# Altium schematic sheet Handmouse.SchDoc
size A4
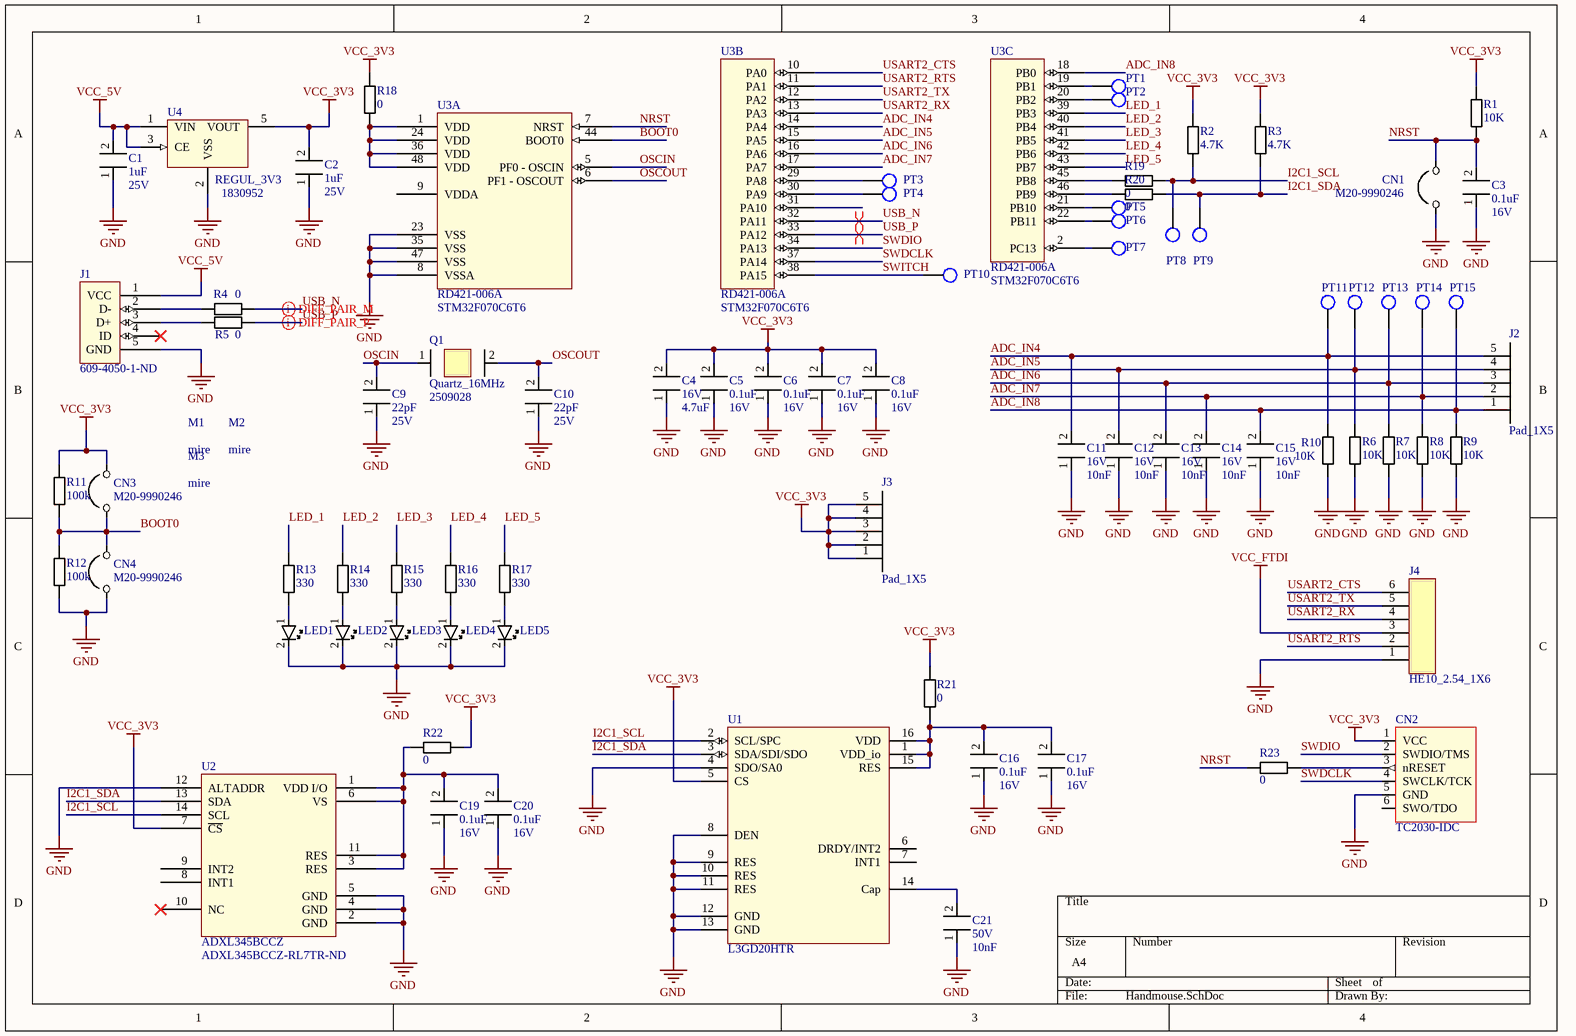
[diagram p0: Handmouse.SchDoc]

## Parts
C1  Capacité: 1uF  Voltage: 25V  [0603]  (hidden comment: RD401-021A)
C2  Capacité: 1uF  Voltage: 25V  [0603]  (hidden comment: RD401-021A)
C3  Capacité: 0.1uF  Voltage: 16V  [0402]  (hidden comment: RD401-033A)
C4  Voltage: 16V  Capacité: 4.7uF  [0805]
C5  Capacité: 0.1uF  Voltage: 16V  [0402]  (hidden comment: RD401-033A)
C6  Capacité: 0.1uF  Voltage: 16V  [0402]  (hidden comment: RD401-033A)
C7  Capacité: 0.1uF  Voltage: 16V  [0402]  (hidden comment: RD401-033A)
C8  Capacité: 0.1uF  Voltage: 16V  [0402]  (hidden comment: RD401-033A)
C9  Voltage: 25V  [0402]  (hidden comment: 22pF)
C10  Voltage: 25V  [0402]  (hidden comment: 22pF)
C11  Voltage: 16V  Capacité: 10nF  [0402]  (hidden comment: RD401-008A)
C12  Voltage: 16V  Capacité: 10nF  [0402]  (hidden comment: RD401-008A)
C13  Voltage: 16V  Capacité: 10nF  [0402]  (hidden comment: RD401-008A)
C14  Voltage: 16V  Capacité: 10nF  [0402]  (hidden comment: RD401-008A)
C15  Voltage: 16V  Capacité: 10nF  [0402]  (hidden comment: RD401-008A)
C16  Capacité: 0.1uF  Voltage: 16V  [0402]  (hidden comment: RD401-033A)
C17  Capacité: 0.1uF  Voltage: 16V  [0402]  (hidden comment: RD401-033A)
C19  Capacité: 0.1uF  Voltage: 16V  [0402]  (hidden comment: RD401-033A)
C20  Capacité: 0.1uF  Voltage: 16V  [0402]  (hidden comment: RD401-033A)
C21  Voltage: 50V  Capacite: 10nF  [0402]  (hidden comment: RD401-037A)
CN1  Manufacturer Part Number 1: M20-9990246  [PinHead 2*1 M]  (hidden comment: RD408-013A)
CN2  Manufacturer Part Number: TC2030-IDC  [TC2030-IDC-FP]  (hidden comment: RD408-022A)
CN3  Manufacturer Part Number 1: M20-9990246  [PinHead 2*1 M]  (hidden comment: RD408-013A)
CN4  Manufacturer Part Number 1: M20-9990246  [PinHead 2*1 M]  (hidden comment: RD408-013A)
J1  Supplier Part Number 1: 609-4050-1-ND  [CONN_10103594-0001LF]  (hidden comment: CONN_FCI_10103594-0001LF)
J2  Pad_1X5  [PCBComponent_1]
J3  Pad_1X5  [PCBComponent_1]
J4  HE10_2.54_1X6  [PCBComponent_1 - duplicate]
LED1  RD405-006A  [0805]  (value not drawn)
LED2  RD405-006A  [0805]  (value not drawn)
LED3  RD405-006A  [0805]  (value not drawn)
LED4  RD405-006A  [0805]  (value not drawn)
LED5  RD405-006A  [0805]  (value not drawn)
M1  mire  [Mire]
M2  mire  [Mire]
M3  mire  [Mire]
PT1  PT 0.8mm  [Pastille_0.8mm]  (value not drawn)
PT2  PT 0.8mm  [Pastille_0.8mm]  (value not drawn)
PT3  PT 0.8mm  [Pastille_0.8mm]  (value not drawn)
PT4  PT 0.8mm  [Pastille_0.8mm]  (value not drawn)
PT5  PT 0.8mm  [Pastille_0.8mm]  (value not drawn)
PT6  PT 0.8mm  [Pastille_0.8mm]  (value not drawn)
PT7  PT 0.8mm  [Pastille_0.8mm]  (value not drawn)
PT8  PT 0.8mm  [Pastille_0.8mm]  (value not drawn)
PT9  PT 0.8mm  [Pastille_0.8mm]  (value not drawn)
PT10  PT 0.8mm  [Pastille_0.8mm]  (value not drawn)
PT11  PT 0.8mm  [Pastille_0.8mm]  (value not drawn)
PT12  PT 0.8mm  [Pastille_0.8mm]  (value not drawn)
PT13  PT 0.8mm  [Pastille_0.8mm]  (value not drawn)
PT14  PT 0.8mm  [Pastille_0.8mm]  (value not drawn)
PT15  PT 0.8mm  [Pastille_0.8mm]  (value not drawn)
Q1  Quartz_16MHz  Supplier Part Number 1: 2509028  [PCBComponent_1 - duplicate2]
R1  Resistance: 10K  [0603]  (hidden comment: RD403-054A)
R2  Résistance (Ohms): 4.7K  [0603]  (hidden comment: RD403-046A)
R3  Résistance (Ohms): 4.7K  [0603]  (hidden comment: RD403-046A)
R4  Résistance: 0  [0603]  (hidden comment: RD403-044A)
R5  Résistance: 0  [0603]  (hidden comment: RD403-044A)
R6  Resistance: 10K  [0603]  (hidden comment: RD403-054A)
R7  Resistance: 10K  [0603]  (hidden comment: RD403-054A)
R8  Resistance: 10K  [0603]  (hidden comment: RD403-054A)
R9  Resistance: 10K  [0603]  (hidden comment: RD403-054A)
R10  Resistance: 10K  [0603]  (hidden comment: RD403-054A)
R11  100k  [0402]
R12  100k  [0402]
R13  330  [0402]
R14  330  [0402]
R15  330  [0402]
R16  330  [0402]
R17  330  [0402]
R18  Résistance: 0  [0603]  (hidden comment: RD403-044A)
R19  Résistance: 0  [0603]  (hidden comment: RD403-044A)
R20  Résistance: 0  [0603]  (hidden comment: RD403-044A)
R21  Résistance: 0  [0603]  (hidden comment: RD403-044A)
R22  Résistance: 0  [0603]  (hidden comment: RD403-044A)
R23  Résistance: 0  [0603]  (hidden comment: RD403-044A)
U1  Manufacturer Part Number 1: L3GD20HTR  [LGA_50P_300X300_16]  (hidden comment: RD498-005A)
U2  ADXL345BCCZ  Supplier Part Number 1: ADXL345BCCZ-RL7TR-ND  [PCBComponent_1 - duplicate1]
U3  RD421-006A  [LQFP48]  (parts A,B,C of 3)
U4  REGUL_3V3  Supplier Part Number 1: 1830952  [SOIC95P280X130-5]

## Nets
GND: C1.1 C2.1 C3.1 C4.1 C5.1 C6.1 C7.1 C8.1 C9.1 C10.1 C11.1 C12.1 C13.1 C14.1 C15.1 C16.1 C17.1 C19.1 C20.1 C21.1 CN1.1 CN2.5(GND) CN4.1 J1.5(GND) J4.1 LED1.2 LED2.2 LED3.2 LED4.2 LED5.2 R6.1 R7.1 R8.1 R9.1 R10.1 R12.1 U1.4(SDO/SA0) U1.8(DEN) U1.9(RES) U1.10(RES) U1.11(RES) U1.12(GND) U1.13(GND) U2.2(GND) U2.4(GND) U2.5(GND) U2.12(ALTADDR) U3.8(VSSA) U3.23(VSS) U3.35(VSS) U3.47(VSS) U4.2(VSS)
VCC_3V3: C2.2 C4.2 C5.2 C6.2 C7.2 C8.2 CN2.1(VCC) CN3.2 J3.1 J3.2 J3.3 J3.4 J3.5 R1.2 R2.2 R3.2 R11.2 R18.2 R21.2 R22.2 U1.5(CS) U2.7(~{CS}) U4.5(VOUT)
VCC_5V: C1.2 J1.1(VCC) U4.1(VIN) U4.3(CE)
VCC_FTDI: J4.3
ADC_IN4: C11.2 J2.5 PT11.1 R10.2 U3.14(PA4)
ADC_IN5: C12.2 J2.4 PT12.1 R6.2 U3.15(PA5)
ADC_IN6: C13.2 J2.3 PT13.1 R7.2 U3.16(PA6)
ADC_IN7: C14.2 J2.2 PT14.1 R8.2 U3.17(PA7)
ADC_IN8: C15.2 J2.1 PT15.1 R9.2 U3.18(PB0)
BOOT0: CN3.1 CN4.2 R11.1 R12.2 U3.44(BOOT0)
I2C1_SCL: PT8.1 R2.1 R19.2 U1.2(SCL/SPC) U2.14(SCL)
I2C1_SDA: PT9.1 R3.1 R20.2 U1.3(SDA/SDI/SDO) U2.13(SDA)
LED_1: R13.2 U3.39(PB3)
LED_2: R14.2 U3.40(PB4)
LED_3: R15.2 U3.41(PB5)
LED_4: R16.2 U3.42(PB6)
LED_5: R17.2 U3.43(PB7)
NRST: C3.2 CN1.2 R1.1 R23.2 U3.7(NRST)
OSCIN: C9.2 Q1.1 U3.5(PF0_-_OSCIN)
OSCOUT: C10.2 Q1.2 U3.6(PF1_-_OSCOUT)
SWDCLK: CN2.4(SWCLK/TCK) U3.37(PA14)
SWDIO: CN2.2(SWDIO/TMS) U3.34(PA13)
SWITCH: PT10.1 U3.38(PA15)
USART2_CTS: J4.6 U3.10(PA0)
USART2_RTS: J4.2 U3.11(PA1)
USART2_RX: J4.4 U3.13(PA3)
USART2_TX: J4.5 U3.12(PA2)
USB_N: R4.2 U3.32(PA11)
USB_P: R5.2 U3.33(PA12)
NetC16_2: C16.2 C17.2 R21.1 U1.1(VDD_io) U1.15(RES) U1.16(VDD)
NetC19_2: C19.2 C20.2 R22.1 U2.1(VDD_I/O) U2.3(RES) U2.6(VS) U2.11(RES)
NetC21_2: C21.2 U1.14(Cap)
NetCN2_3: CN2.3(nRESET) R23.1
NetJ1_2: J1.2(D-) R4.1
NetJ1_3: J1.3(D+) R5.1
NetLED1_1: LED1.1 R13.1
NetLED2_1: LED2.1 R14.1
NetLED3_1: LED3.1 R15.1
NetLED4_1: LED4.1 R16.1
NetLED5_1: LED5.1 R17.1
NetPT1_1: PT1.1 U3.19(PB1)
NetPT2_1: PT2.1 U3.20(PB2)
NetPT3_1: PT3.1 U3.29(PA8)
NetPT4_1: PT4.1 U3.30(PA9)
NetPT5_1: PT5.1 U3.21(PB10)
NetPT6_1: PT6.1 U3.22(PB11)
NetPT7_1: PT7.1 U3.2(PC13)
NetR18_1: R18.1 U3.1(VDD) U3.24(VDD) U3.36(VDD) U3.48(VDD)
NetR19_1: R19.1 U3.45(PB8)
NetR20_1: R20.1 U3.46(PB9)

Not connected (* = marked no-connect by the designer): CN2 6(SWO/TDO); J1 4(ID)*; U1 6(DRDY/INT2) 7(INT1); U2 8(INT1) 9(INT2) 10(NC)*; U3 9(VDDA) 31(PA10); U4 4(NC)

## Layout directives
differential pair: USB_N, USB_P

## Library data of the parts
C1 C2 = RD401-021A: CAP CER 0603 1uF 25V X7R 10%; Manufacturer: AVX; Manufacturer Part Number: 0603YC105KAT2A; Supplier 1: Farnell; Supplier Part Number 1: 1658870; RoHS: YES; Stock 1: 70593; Pricing 1: 10=0,142, 100=0,126, 500=0,0525, 1000=0,0394, 2000=0,0315 (EUR); ComponentLink1URL: http://www.farnell.com/datasheets/1679506.pdf; ComponentLink1Description: http://www.farnell.com/datasheets/1679506.pdf; ComponentLink2URL: http://www.farnell.com/cad/1614345.zip; ComponentLink2Description: http://www.farnell.com/cad/1614345.zip
C3 C5-C8 C16 C17 C19 C20 = RD401-033A: CAP CER 0402 0.1uF 16V X7R 5%; Manufacturer: KEMET; Manufacturer Part Number: C0402C104J4RACTU; Supplier 1: Farnell; RoHS: YES; Stock 1: 23119; Pricing 1: 10=0,211, 50=0,19, 100=0,153, 500=0,123, 1000=0,0975, 10000=0,0775 (EUR); ComponentLink1URL: http://www.farnell.com/datasheets/1851736.pdf; ComponentLink1Description: http://www.farnell.com/datasheets/1851736.pdf; Supplier Part Number 1: 2429353
C4 = RD401-025A: CAP CER 0805 4.7uF 16V X7R 10%; Manufacturer: AVX; Manufacturer Part Number: 0805YC475KAT2A; Diélectrique: X7; Boîtier de condensateur Céramique: 0805 [2012 Metric]; Température d'utilisation min: -55; Température de fonctionnement max..: 125; Type de packaging: Bande découpée; SVHC: No SVHC (17-Dec-2014); Bornes de condensateur: CMS; Température de fonctionnement: -55°C à +125; Tolérance de capacité ±: ± 10; Supplier 1: Farnell; RoHS: YES; Stock 1: 50693; Pricing 1: 5=0,467, 50=0,298, 250=0,149, 500=0,12, 1500=0,0994 (EUR); Gamme de produit: -; Tolérance de capacité: ± 10%; MSL: MSL 1 - Illimité; ComponentLink1URL: http://www.farnell.com/datasheets/1679506.pdf; ComponentLink1Description: http://www.farnell.com/datasheets/1679506.pdf; ComponentLink2URL: http://www.farnell.com/cad/1614401.zip; ComponentLink2Description: http://www.farnell.com/cad/1614401.zip; Supplier Part Number 1: 1657937; Supplier 2: Mouser; Supplier 3: RS-Components; Supplier Part Number 2: 581-0805YC475KAT2A; Supplier Part Number 3: 698-3554
C9 C10 = RD401-009A: CAP CER 0402 22pF 25V COG 1%; Manufacturer 1: MULTICOMP; Manufacturer Part Number 1: MCMT15N220F250CT; purchase_ok: True; cost_method: StandardPrice; name_category: Achat\Elec\CAP; Name_Route: Buy; sale_ok: False; type: StockableProduct; Supplier 1: Farnell; Supplier Part Number 1: 1856059; RoHS: YES; Stock 1: 19800; Pricing 1: 100=0,0077, 500=0,0066, 1000=0,0056, 10000=0,0043 (EUR); ComponentLink1URL: http://www.farnell.com/datasheets/1825496.pdf; ComponentLink1Description: http://www.farnell.com/datasheets/1825496.pdf; Value: 22pF
C11-C15 = RD401-008A: CAP CER 0402 10nF 16V X7R 5%; Manufacturer 1: MULTICOMP; Manufacturer Part Number 1: MC0402B103J160CT; Gamme de produit: MULTICOMP - MC Series; Diélectrique: X7; Boîtier de condensateur Céramique: 0402 [1005 Metric]; Température d'utilisation min: -55; Température de fonctionnement max..: 125; Type de packaging: Bande découpée; Bornes de condensateur: CMS; Type de boîtier de condensateur: 0402 [1005 Metric]<!--FANDB--><div class="features-and-benefits-container"></div>; purchase_ok: True; cost_method: StandardPrice; name_category: Achat\Elec\CAP; Name_Route: Buy; sale_ok: False; type: StockableProduct; Supplier 1: Farnell; Supplier Part Number 1: 2320775; RoHS: YES; Stock 1: 30490; Pricing 1: 10=0,0085, 100=0,0075, 500=0,0064, 1000=0,0054, 5000=0,0042 (EUR); Tolérance de capacité: ± 5%; MSL: MSL 1 - Illimité; Tolérance de capacité ±: ± 5%; ComponentLink1URL: http://www.farnell.com/datasheets/1870456.pdf; ComponentLink1Description: http://www.farnell.com/datasheets/1870456.pdf
C21 = RD401-037A: CAP CER 0402 10nF 50V X7R 10%; Manufacturer: KEMET; Manufacturer Part Number: C0402C103K5RACTU; Supplier 1: Farnell; Supplier Part Number 1: 1414575; RoHS: YES; Stock 1: 239866; Pricing 1: 10=0,0207, 100=0,0142, 500=0,0088, 2500=0,0076, 5000=0,0069, 10000=0,005, 50000=0,0038, 100000=0,0031 (EUR); ComponentLink1URL: http://www.farnell.com/datasheets/1851736.pdf; ComponentLink1Description: http://www.farnell.com/datasheets/1851736.pdf; ComponentLink2URL: http://www.farnell.com/cad/1558610.zip; ComponentLink2Description: http://www.farnell.com/cad/1558610.zip
CN1 CN3 CN4 = RD408-013A: JUMPER; Manufacturer 1: Harwin; Nombre de positions: 2; Nombre de lignes: 1; Produit: Headers; Quantité standard du lot: 1000; cost_method: Standard Price; name_category: Achat\Elec; Name_route: Buy; purchase_ok: True; sale_ok: False; Supplier 1: Mouser; Supplier Part Number 1: 855-M20-9990246; Stock 1: 18075; Pricing 1: 1=0.091, 10=0.057, 100=0.045, 1000=0.040, 2000=0.032, 10000=0.031, 25000=0.030, 50000=0.029 (EUR); type: Stockable Product; Minimum Order Quantity: 1; Reeling: False; ComponentLink1URL: http://www.mouser.com/ds/2/181/M20-999-351179.pdf; ComponentLink1Description: Drawings; Supplier 2: RS-Components; Supplier Part Number 2: 745-7065P; Supplier 3: Farnell; Supplier Part Number 3: 1022247
CN2 = RD408-022A: CON SWD; Manufacturer: Tag-Connect LLC; cost_method: Standard Price; name_category: Achat\Elec; Name_route: Buy; purchase_ok: True; sale_ok: False; Type d’accessoire: Câble adaptateur; type: Stockable Product; ff: TC2030-IDC-FP; Supplier 1: Digi-Key; RoHS: RoHS Compliant; Category: Programmateurs, systèmes de développement; Stock 1: 0; Pricing 1: 7=60.45143 (EUR); Destiné à être utilisé avec les produits correspondants: -; Supplier Part Number 1: TC2030-IDC-ND
J1 = CONN_FCI_10103594-0001LF: CONN MICROUSB FCI 10103594-0001LF; Manufacturer: Amphenol FCI; Conditionnement: Bande coupée (CT); Statut de la pièce: Actif; Type de connecteur: USB - micro B; Nombre de contacts: 5; Sexe: Prise; Spécifications: USB 2,0; Type de montage: Montage en surface à angle droit, horizontal; Caractéristiques: Blindé, soudure de maintien; Supplier 1: Digi-Key; Manufacturer Part Number: 10103594-0001LF; RoHS: RoHS Compliant; Category: Connecteurs, interconnexions; Stock 1: 68830; Pricing 1: 1=0.65, 10=0.609, 25=0.5492, 50=0.488, 100=0.4676, 250=0.42692, 500=0.4066 (EUR); Protection contre les entrées: -; ComponentLink1URL: http://portal.fciconnect.com/Comergent//fci/drawing/10103594.pdf; ComponentLink1Description: http://portal.fciconnect.com/Comergent//fci/drawing/10103594.pdf
LED1-LED5 = RD405-006A: DIO LED SMT ? 30mA Rouge; Manufacturer 1: WURTH ELEKTRONIK; Manufacturer Part Number 1: 150080RS75000; cost_method: Standard Price; name_category: Achat\Elec; purchase_ok: True; sale_ok: False; type: Stockable Product; Supplier 1: Farnell; Supplier Part Number 1: 2322077; RoHS: YES; Stock 1: 4155; Pricing 1: 1=0,281, 50=0,239, 100=0,2, 500=0,183, 2000=0,163, 4000=0,147, 20000=0,13, 40000=0,117 (EUR); ComponentLink1URL: http://katalog.we-online.de/led/datasheet/150080RS75000.pdf; ComponentLink1Description: Datasheet; Supplier 2: Mouser; Supplier Part Number 2: 710-150080RS75000; Supplier 3: RS-Components; Supplier Part Number 3: 815-4225
PT1-PT15 = PT 0.8mm: Point de test pastille 0.8mm
Q1 = Quartz_16MHz: Quartz 16MHz; Manufacturer: RALTRON; Manufacturer Part Number: AS-16.000-18-SMD; Supplier 1: Farnell; RoHS: YES; Stock 1: 207; Pricing 1: 1=0,455, 5=0,452, 10=0,45, 20=0,447, 40=0,439, 100=0,369, 500=0,318, 1000=0,267 (EUR); ComponentLink1URL: http://www.farnell.com/datasheets/1998828.pdf; ComponentLink1Description: http://www.farnell.com/datasheets/1998828.pdf
R1 R6-R10 = RD403-054A: RES 0603 10K 1% 0.1W; Manufacturer: VISHAY DRALORIC; Manufacturer Part Number: CRCW060310K0FKEA; Supplier 1: Farnell; Supplier Part Number 1: 1469748; RoHS: Y-EX; Stock 1: 42314; Pricing 1: 10=0,017, 100=0,0134, 500=0,0127, 1000=0,009, 2500=0,0035 (EUR); ComponentLink1URL: http://www.farnell.com/datasheets/1720486.pdf; ComponentLink1Description: http://www.farnell.com/datasheets/1720486.pdf; ComponentLink2URL: http://www.farnell.com/cad/1551982.zip; ComponentLink2Description: http://www.farnell.com/cad/1551982.zip
R2 R3 = RD403-046A: RES 0603 4.7K 1% 0.1W; Manufacturer: Vishay Dale; Manufacturer Part Number: CRCW06034K70FKEA; Conditionnement: Bande coupée (CT); Puissance (Watts): 0,1W, 1/10W; Caractéristiques: Automobile AEC-Q200; Coefficient de température: ±100ppm/°C; Température d’utilisation: -55°C ~ 155°C; Boîtier: 0603 (1608 Metric); Hauteur: 0,020 po (0,50 mm); Nombre de bornes: 2; Supplier 1: Digi-Key; RoHS: RoHS Compliant; Category: Résistances; Stock 1: 412277; Pricing 1: 10=0.079, 50=0.0428, 200=0.0246, 1000=0.01676 (EUR); Tolérance: ±1%; Composition: Couche épaisse; Boîtier fournisseur: 0603 (1608 Metric); Taille/Dimension: 0,061 po L x 0,033 po l (1,55 mm x 0,85 mm); ComponentLink1URL: http://www.vishay.com/docs/20035/dcrcwe3.pdf; ComponentLink1Description: http://www.vishay.com/docs/20035/dcrcwe3.pdf; Supplier Part Number 1: 541-4.70KHCT-ND
R4 R5 R18-R23 = RD403-044A: RES 0603 0 1% 0.1W; Manufacturer: VISHAY DRALORIC; Manufacturer Part Number: CRCW06030000Z0EA; Gamme de produit: Série AEC-Q200 CRCW; Puissance: 100; Tension: 75; Type de boîtier de résistance: 0603 [1608 Metric]; Type de packaging: Bande découpée; SVHC: No SVHC (17-Dec-2014); Montage de résistance: CMS; Type de résistance: Couche épaisse<!--FANDB--><div class="features-and-benefits-container"><div class="features-and-benefits-description"><span class="features-benefits-value">The Vishay D/CRCW e3 series are standard thick film chip resistors. The resistance range includes E96 and E24 decade values from 1ohm to 10Mohm. CRCW e3 series resistors have a pure tin solder contacts on the Ni barrier layer that provides compatibility with reflow soldering process.</span></div><div class="features-and-benefits-list"><ul class="features-and-benefits-list-list"><li class="features-and-benefits-list-item">Automotive grade AEC-Q200 qualified</li><li class="features-and-benefits-list-item">EIA 0402, 0603, 0805, 1206, 1210, 1218, 2010, 2512 standard case sizes available</li><li class="features-and-benefits-list-item">Stability &Delta; Supplier 1: Farnell; RoHS: Y-EX; Stock 1: 24153; Pricing 1: 10=0,017, 100=0,0162, 500=0,0127, 1000=0,009, 2500=0,0031 (EUR); Tolérance de résistance: -; Coefficient de température: -; MSL: MSL 1 - Illimité; ComponentLink1URL: http://www.farnell.com/datasheets/1720486.pdf; ComponentLink1Description: http://www.farnell.com/datasheets/1720486.pdf; ComponentLink2URL: http://www.farnell.com/cad/1551945.zip; ComponentLink2Description: http://www.farnell.com/cad/1551945.zip; Supplier Part Number 1: 1469739
R11 R12 = RD403-007A: RES 0402 100k 1% 0.063W; Manufacturer 1: Vishay / Dale; Manufacturer Part Number 1: CRCW0402100KFKED; Puissance: 63; Type de boîtier de résistance: 0402 [1005 Metric]; Coefficient de température: ± 100; Tension: 50; purchase_ok: True; cost_method: StandardPrice; name_category: Achat\Elec\RES; Name_Route: Buy; sale_ok: False; Supplier 1: Farnell; Supplier Part Number 1: 1469671; RoHS: Y-EX; Stock 1: 72625; Pricing 1: 50=0,0229, 250=0,0208, 1000=0,0196, 5000=0,0175, 10000=0,0153 (EUR); Value: 100k; Tolérance de résistance: ± 1%; ComponentLink1URL: http://www.farnell.com/datasheets/1720486.pdf; ComponentLink1Description: http://www.farnell.com/datasheets/1720486.pdf; Supplier 2: RS-Components; Supplier Part Number 2: 678-4684; Supplier 3: Mouser; Supplier Part Number 3: 71-CRCW0402100KFKEDH; id: RD403-007A; type: StockableProduct
R13-R17 = RD403-014A: RES 0402 330 1% 0.063W; Manufacturer 1: TE CONNECTIVITY; Manufacturer Part Number 1: CRG0402F330R; Plage de températures de fonctionnement: - 55 C to + 125 C; Package/Boîte: 0402 (1005 metric); Série: CRG; Tension de voltage: 50 V; Quantité standard du lot: 10000; purchase_ok: True; cost_method: StandardPrice; name_category: Achat\Elec\RES; Name_Route: Buy; sale_ok: False; Supplier 1: Farnell; Supplier Part Number 1: 2331511; RoHS: YES; Stock 1: 20340; Pricing 1: 10=0,0084, 100=0,0063, 1000=0,0053, 5000=0,0031, 10000=0,0021 (EUR); ComponentLink1URL: http://www.farnell.com/datasheets/1610603.pdf; ComponentLink1Description: http://www.farnell.com/datasheets/1610603.pdf; Supplier 2: Mouser; Supplier Part Number 2: 279-CRG0402F330R; Value: 330; Tolérance: 1 %; RoHS - Mouser: Y; Minimum Order Quantity: 10000; Reeling: True; Supplier 3: RS-Components; Supplier Part Number 3: 667-8646; id: RD403-014A
U1 = RD498-005A: Gyroscopes MEMS motion sensor 3axis digital output; Manufacturer 1: STMicroelectronics; Hauteur: 1 mm; Longueur: 4 mm; Package/Boîte: LGA-16; Conditionnement: Reel; Plage: +/- 245 deg/s, +/- 500 deg/s, +/- 2000 deg/s; Sensibilité: 70 mdps/digit; Série: L3GD20H; Alimentation en courant: 5 mA; Accélération: 10000 g; Sortie numérique - Interface bus: I2C, SPI; Sortie numérique - Nombre de bits: 16 bit; Axe de détection: X, Y, Z; Température de fonctionnement max.: + 85 C; Température de fonctionnement min.: - 40 C; Quantité standard du lot: 4000; Tension d’alimentation - Max.: 3.6 V; Tension d’alimentation - Min.: 2.2 V; Product Status: New Product; Supplier 1: Mouser; Supplier Part Number 1: 511-L3GD20HTR; RoHS: RoHS Compliant; Category: Gyroscopes; Stock 1: 3364; Pricing 1: 1=3.45, 10=2.77, 100=2.46, 250=2.27, 500=2.04, 1000=1.72, 4000=1.63 (EUR); Type de sortie: Digital; Largeur: 4 mm; Marque: STMicroelectronics; Fabricant: STMicroelectronics; RoHS - Mouser: Y; Minimum Order Quantity: 1; Reeling: True; ComponentLink1URL: http://www.mouser.com/ds/2/389/DM00060659-490661.pdf; ComponentLink1Description: http://www.mouser.com/ds/2/389/DM00060659-490661.pdf
U2 = ADXL345BCCZ: Manufacturer: Analog Devices Inc.; Manufacturer Part Number: ADXL345BCCZ-RL7; Conditionnement: Bande et bobine; Statut de la pièce: Actif; Axe: X, Y, Z; Plage d’accélération: ±2g, 4g, 8g, 16g; Sensibilité (LSB/g): 256 (±2g) ~ 32 (±16g); Largeur de bande: 0,05Hz ~ 1,6kHz; Type de sortie: I²C, SPI; Alimentation en tension: 2 V ~ 3,6 V; Caractéristiques: Bande passante ajustable; Température d’utilisation: -40°C ~ 85°C (TA); Type de montage: Montage en surface; Boîtier: 14-VFLGA; Boîtier fournisseur: 14-LGA (3x5); Supplier 1: Digi-Key; RoHS: RoHS Compliant; Category: Capteurs, transducteurs; Stock 1: 1500; Pricing 1: 1500=3.64419, 3000=3.50922, 7500=3.37425, 10500=3.32233 (EUR); Type: Numérique; Sensibilité (mV/g): -; ComponentLink1URL: http://www.analog.com/media/en/technical-documentation/data-sheets/ADXL345.pdf; ComponentLink1Description: http://www.analog.com/media/en/technical-documentation/data-sheets/ADXL345.pdf
U3 = RD421-006A: STM32F070C6T6; Manufacturer: STMICROELECTRONICS; Architecture: ARM Cortex-M0; Vitesse de processeur: 48; Taille de mémoire programme: 32; Taille mémoire, RAM: 6; Type de boîtier MCU: LQFP; Nombre d'E/S: 37; Type d'interface embarquée: I2; Tension, alimentation min.: 2.4; Tension, alimentation max..: 3.6; Type de packaging: Pièce; Gamme de produit: STM32 F0 ARM Cortex-M0 Microcontrollers; SVHC: No SVHC (17-Dec-2015)<!--FANDB--><div class="features-and-benefits-container"><div class="features-and-benefits-description"><span class="features-benefits-value">The STM32F070C6T6 is an entry level STM32 F0 series 32-bit Microcontroller incorporates the high-performance ARM Cortex-M0 RISC core operating at a 48MHz frequency, high speed embedded memories (Flash memory up to 32kB and SRAM up to 6KB) and an extensive range of enhanced peripherals and I/Os. This device offer standard communication interfaces (one I²C, one SPI and two USARTs), one USB full speed device, one 12-bit ADC, four general-purpose 16-bit timers and an advanced control PWM timer.</span></div><div class="features-and-benefits-list"><ul class="features-and-benefits-list-list"><li class="features-and-benefits-list-item">CRC calculation unit</li><li class="features-and-benefits-list-item">Power-on/Power-down reset (POR/PDR)</li><li class="features-and-benefits-list-item">Low power modes - Sleep, stop, standby</li><li class="features-and-benefits-list-item">4 to 32MHz Crystal oscillator</li><li class="features-and-benefits-list-item">32kHz Oscillator for RTC with calibration</li><li class="features-and-benefits-list-item">Internal 8MHz RC with x6 PLL option</li><li class="features-and-benefits-list-item">Internal 40kHz RC oscillator</li><li class="features-and-benefits-list-item">5-channel DMA Controller</li><li class="features-and-benefits-list-item">Calendar RTC with alarm and periodic wakeup from Stop/Standby</li><li class="features-and-benefits-list-item">Independent and system watchdog timers</li><li class="features-and-benefits-list-item">SysTick Timer</li><li class="features-and-benefits-list-item">USB 2.0 full speed interface with BCD and LPM support</li><li class="features-and-benefits-list-item">Serial wire debug (SWD)</li></ul></div><div class="features-and-benefits-applications"><ul class="features-and-benefits-value"><li class="features-and-benefits-list-item">Automatisme et contrôle de Process</li><li class="features-and-benefits-list-item">Périphériques Portables</li><li class="features-and-benefits-list-item">Audio</li><li class="features-and-benefits-list-item">Communications et Réseaux</li><li class="features-and-benefits-list-item">Computers & Computer Peripherals</li><li class="features-and-benefits-list-item">Electronique Grand Public</li><li class="features-and-benefits-list-item">Industrie</li><li class="features-and-benefits-list-item">Imagerie, Video et Vision</li><li class="features-and-benefits-list-item">Sécurité</li><li class="features-and-benefits-list-item">HVAC</li></ul></div></div>; Supplier 1: Farnell; RoHS: YES; Stock 1: 786; Pricing 1: 1=1,88, 10=1,53, 25=1,48, 50=1,25, 100=1,16, 500=0,919 (EUR); Nombre de broches: 48; Normes Qualification Automobile: -; MSL: -; ComponentLink1URL: http://www.farnell.com/datasheets/1943789.pdf; ComponentLink1Description: http://www.farnell.com/datasheets/1943789.pdf; ComponentLink2URL: http://www.farnell.com/datasheets/2042639.pdf; ComponentLink2Description: http://www.farnell.com/datasheets/2042639.pdf; Supplier Part Number 1: 2488283; Manufacturer Part Number: STM32F070C6T6
U4 = REGUL_3V3: Manufacturer: TOREX; Manufacturer Part Number: XC6222D331MR-G; Supplier 1: Farnell; RoHS: YES; Stock 1: 3119; Pricing 1: 1=0,747, 10=0,606, 100=0,485, 250=0,417, 500=0,367, 1000=0,34, 2000=0,332, 5000=0,323 (EUR); ComponentLink1URL: http://www.farnell.com/datasheets/2012851.pdf; ComponentLink1Description: http://www.farnell.com/datasheets/2012851.pdf